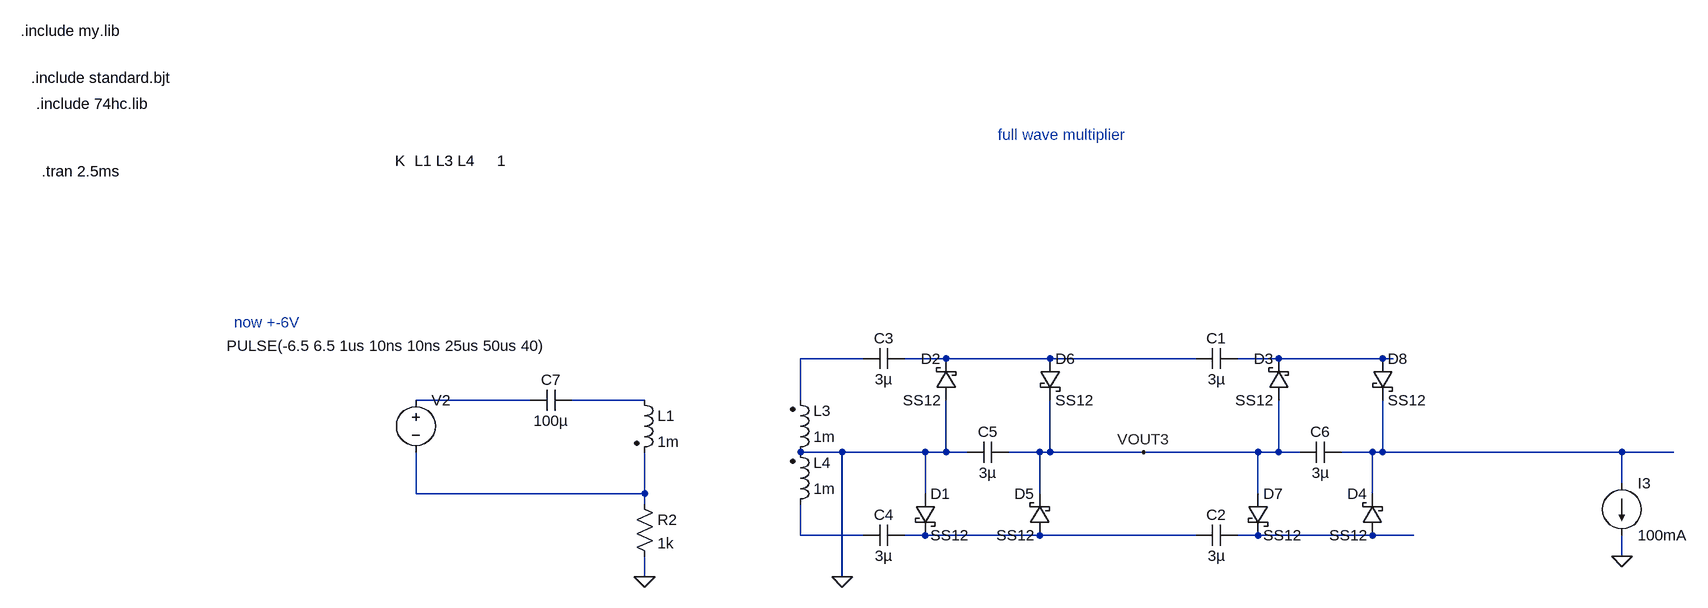
[diagram p0: schematic Draft27.asc]
Draft27.asc, the LTspice schematic file:
Version 4
SHEET 1 5720 1740
WIRE 1840 -192 1744 -192
WIRE 1968 -192 1904 -192
WIRE 2128 -192 1968 -192
WIRE 2352 -192 2128 -192
WIRE 2480 -192 2416 -192
WIRE 2640 -192 2480 -192
WIRE 2656 -192 2640 -192
WIRE 1328 -128 1152 -128
WIRE 1504 -128 1392 -128
WIRE 1744 -128 1744 -192
WIRE 1808 -48 1744 -48
WIRE 1936 -48 1808 -48
WIRE 1968 -48 1968 -128
WIRE 1968 -48 1936 -48
WIRE 2000 -48 1968 -48
WIRE 2112 -48 2064 -48
WIRE 2128 -48 2128 -128
WIRE 2128 -48 2112 -48
WIRE 2272 -48 2128 -48
WIRE 2448 -48 2272 -48
WIRE 2480 -48 2480 -128
WIRE 2480 -48 2448 -48
WIRE 2512 -48 2480 -48
WIRE 2624 -48 2576 -48
WIRE 2640 -48 2640 -128
WIRE 2640 -48 2624 -48
WIRE 3008 -48 2640 -48
WIRE 3088 -48 3008 -48
WIRE 3008 0 3008 -48
WIRE 1152 16 1152 -48
WIRE 1504 16 1504 -48
WIRE 1504 16 1152 16
WIRE 1936 16 1936 -48
WIRE 2112 16 2112 -48
WIRE 2448 16 2448 -48
WIRE 2624 16 2624 -48
WIRE 1504 32 1504 16
WIRE 1744 80 1744 32
WIRE 1840 80 1744 80
WIRE 1936 80 1904 80
WIRE 2112 80 1936 80
WIRE 2352 80 2112 80
WIRE 2448 80 2416 80
WIRE 2624 80 2448 80
WIRE 2688 80 2624 80
WIRE 3008 112 3008 80
WIRE 1504 144 1504 112
WIRE 1808 144 1808 -48
FLAG 1808 144 0
FLAG 1504 144 0
FLAG 2272 -48 VOUT3
FLAG 3008 112 0
SYMBOL ind2 1728 -32 M180
WINDOW 0 36 80 Left 2
WINDOW 3 36 40 Left 2
SYMATTR InstName L3
SYMATTR Value 1m
SYMATTR Type ind
SYMBOL ind2 1728 48 M180
WINDOW 0 36 80 Left 2
WINDOW 3 36 40 Left 2
SYMATTR InstName L4
SYMATTR Value 1m
SYMATTR Type ind
SYMBOL ind2 1488 -144 R0
SYMATTR InstName L1
SYMATTR Value 1m
SYMATTR Type ind
SYMBOL voltage 1152 -144 R0
WINDOW 123 0 0 Left 0
WINDOW 39 0 0 Left 0
WINDOW 3 -291 -68 Left 2
SYMATTR Value PULSE(-6.5 6.5 1us 10ns 10ns 25us 50us 40)
SYMATTR InstName V2
SYMBOL cap 1904 -208 R90
WINDOW 0 0 32 VBottom 2
WINDOW 3 32 32 VTop 2
SYMATTR InstName C3
SYMATTR Value 3µ
SYMBOL cap 1904 64 R90
WINDOW 0 0 32 VBottom 2
WINDOW 3 32 32 VTop 2
SYMATTR InstName C4
SYMATTR Value 3µ
SYMBOL cap 2000 -32 R270
WINDOW 0 32 32 VTop 2
WINDOW 3 0 32 VBottom 2
SYMATTR InstName C5
SYMATTR Value 3µ
SYMBOL current 3008 0 R0
WINDOW 123 0 0 Left 0
WINDOW 39 0 0 Left 0
SYMATTR InstName I3
SYMATTR Value 100mA
SYMBOL schottky 1984 -128 R180
WINDOW 0 24 64 Left 2
WINDOW 3 24 0 Left 2
SYMATTR InstName D2
SYMATTR Value SS12
SYMATTR Description Diode
SYMATTR Type diode
SYMBOL schottky 2128 80 R180
WINDOW 0 24 64 Left 2
WINDOW 3 24 0 Left 2
SYMATTR InstName D5
SYMATTR Value SS12
SYMATTR Description Diode
SYMATTR Type diode
SYMBOL schottky 1920 16 R0
SYMATTR InstName D1
SYMATTR Value SS12
SYMATTR Description Diode
SYMATTR Type diode
SYMBOL schottky 2112 -192 R0
SYMATTR InstName D6
SYMATTR Value SS12
SYMATTR Description Diode
SYMATTR Type diode
SYMBOL cap 2416 -208 R90
WINDOW 0 0 32 VBottom 2
WINDOW 3 32 32 VTop 2
SYMATTR InstName C1
SYMATTR Value 3µ
SYMBOL cap 2416 64 R90
WINDOW 0 0 32 VBottom 2
WINDOW 3 32 32 VTop 2
SYMATTR InstName C2
SYMATTR Value 3µ
SYMBOL cap 2512 -32 R270
WINDOW 0 32 32 VTop 2
WINDOW 3 0 32 VBottom 2
SYMATTR InstName C6
SYMATTR Value 3µ
SYMBOL schottky 2496 -128 R180
WINDOW 0 24 64 Left 2
WINDOW 3 24 0 Left 2
SYMATTR InstName D3
SYMATTR Value SS12
SYMATTR Description Diode
SYMATTR Type diode
SYMBOL schottky 2640 80 R180
WINDOW 0 24 64 Left 2
WINDOW 3 24 0 Left 2
SYMATTR InstName D4
SYMATTR Value SS12
SYMATTR Description Diode
SYMATTR Type diode
SYMBOL schottky 2432 16 R0
SYMATTR InstName D7
SYMATTR Value SS12
SYMATTR Description Diode
SYMATTR Type diode
SYMBOL schottky 2624 -192 R0
SYMATTR InstName D8
SYMATTR Value SS12
SYMATTR Description Diode
SYMATTR Type diode
SYMBOL res 1488 16 R0
SYMATTR InstName R2
SYMATTR Value 1k
SYMBOL cap 1392 -144 R90
WINDOW 0 0 32 VBottom 2
WINDOW 3 32 32 VTop 2
SYMATTR InstName C7
SYMATTR Value 100µ
TEXT 576 -480 Left 2 !.tran 2.5ms
TEXT 1120 -496 Left 2 !K  L1 L3 L4     1
TEXT 560 -624 Left 2 !.include standard.bjt
TEXT 544 -696 Left 2 !.include my.lib
TEXT 568 -584 Left 2 !.include 74hc.lib
TEXT 872 -248 Left 2 ;now +-6V
TEXT 2048 -536 Left 2 ;full wave multiplier

The netlist it stands for:
* Draft27.asc
L3 0 N001 1m
L4 N008 0 1m
L1 N005 N007 1m
V2 N004 N007 PULSE(-6.5 6.5 1us 10ns 10ns 25us 50us 40)
C3 N002 N001 3µ
C4 N009 N008 3µ
C5 0 VOUT3 3µ
I3 N006 0 100mA
D2 0 N002 SS12
D5 N009 VOUT3 SS12
D1 0 N009 SS12
D6 N002 VOUT3 SS12
C1 N003 N002 3µ
C2 N010 N009 3µ
C6 VOUT3 N006 3µ
D3 VOUT3 N003 SS12
D4 N010 N006 SS12
D7 VOUT3 N010 SS12
D8 N003 N006 SS12
R2 N007 0 1k
C7 N005 N004 100µ
.model D D
.lib standard.dio
.tran 2.5ms
K  L1 L3 L4     1
.include standard.bjt
.include my.lib
.include 74hc.lib
* now +-6V
* full wave multiplier
.backanno
.end